# Altium project Module_wifi.PrjPcb
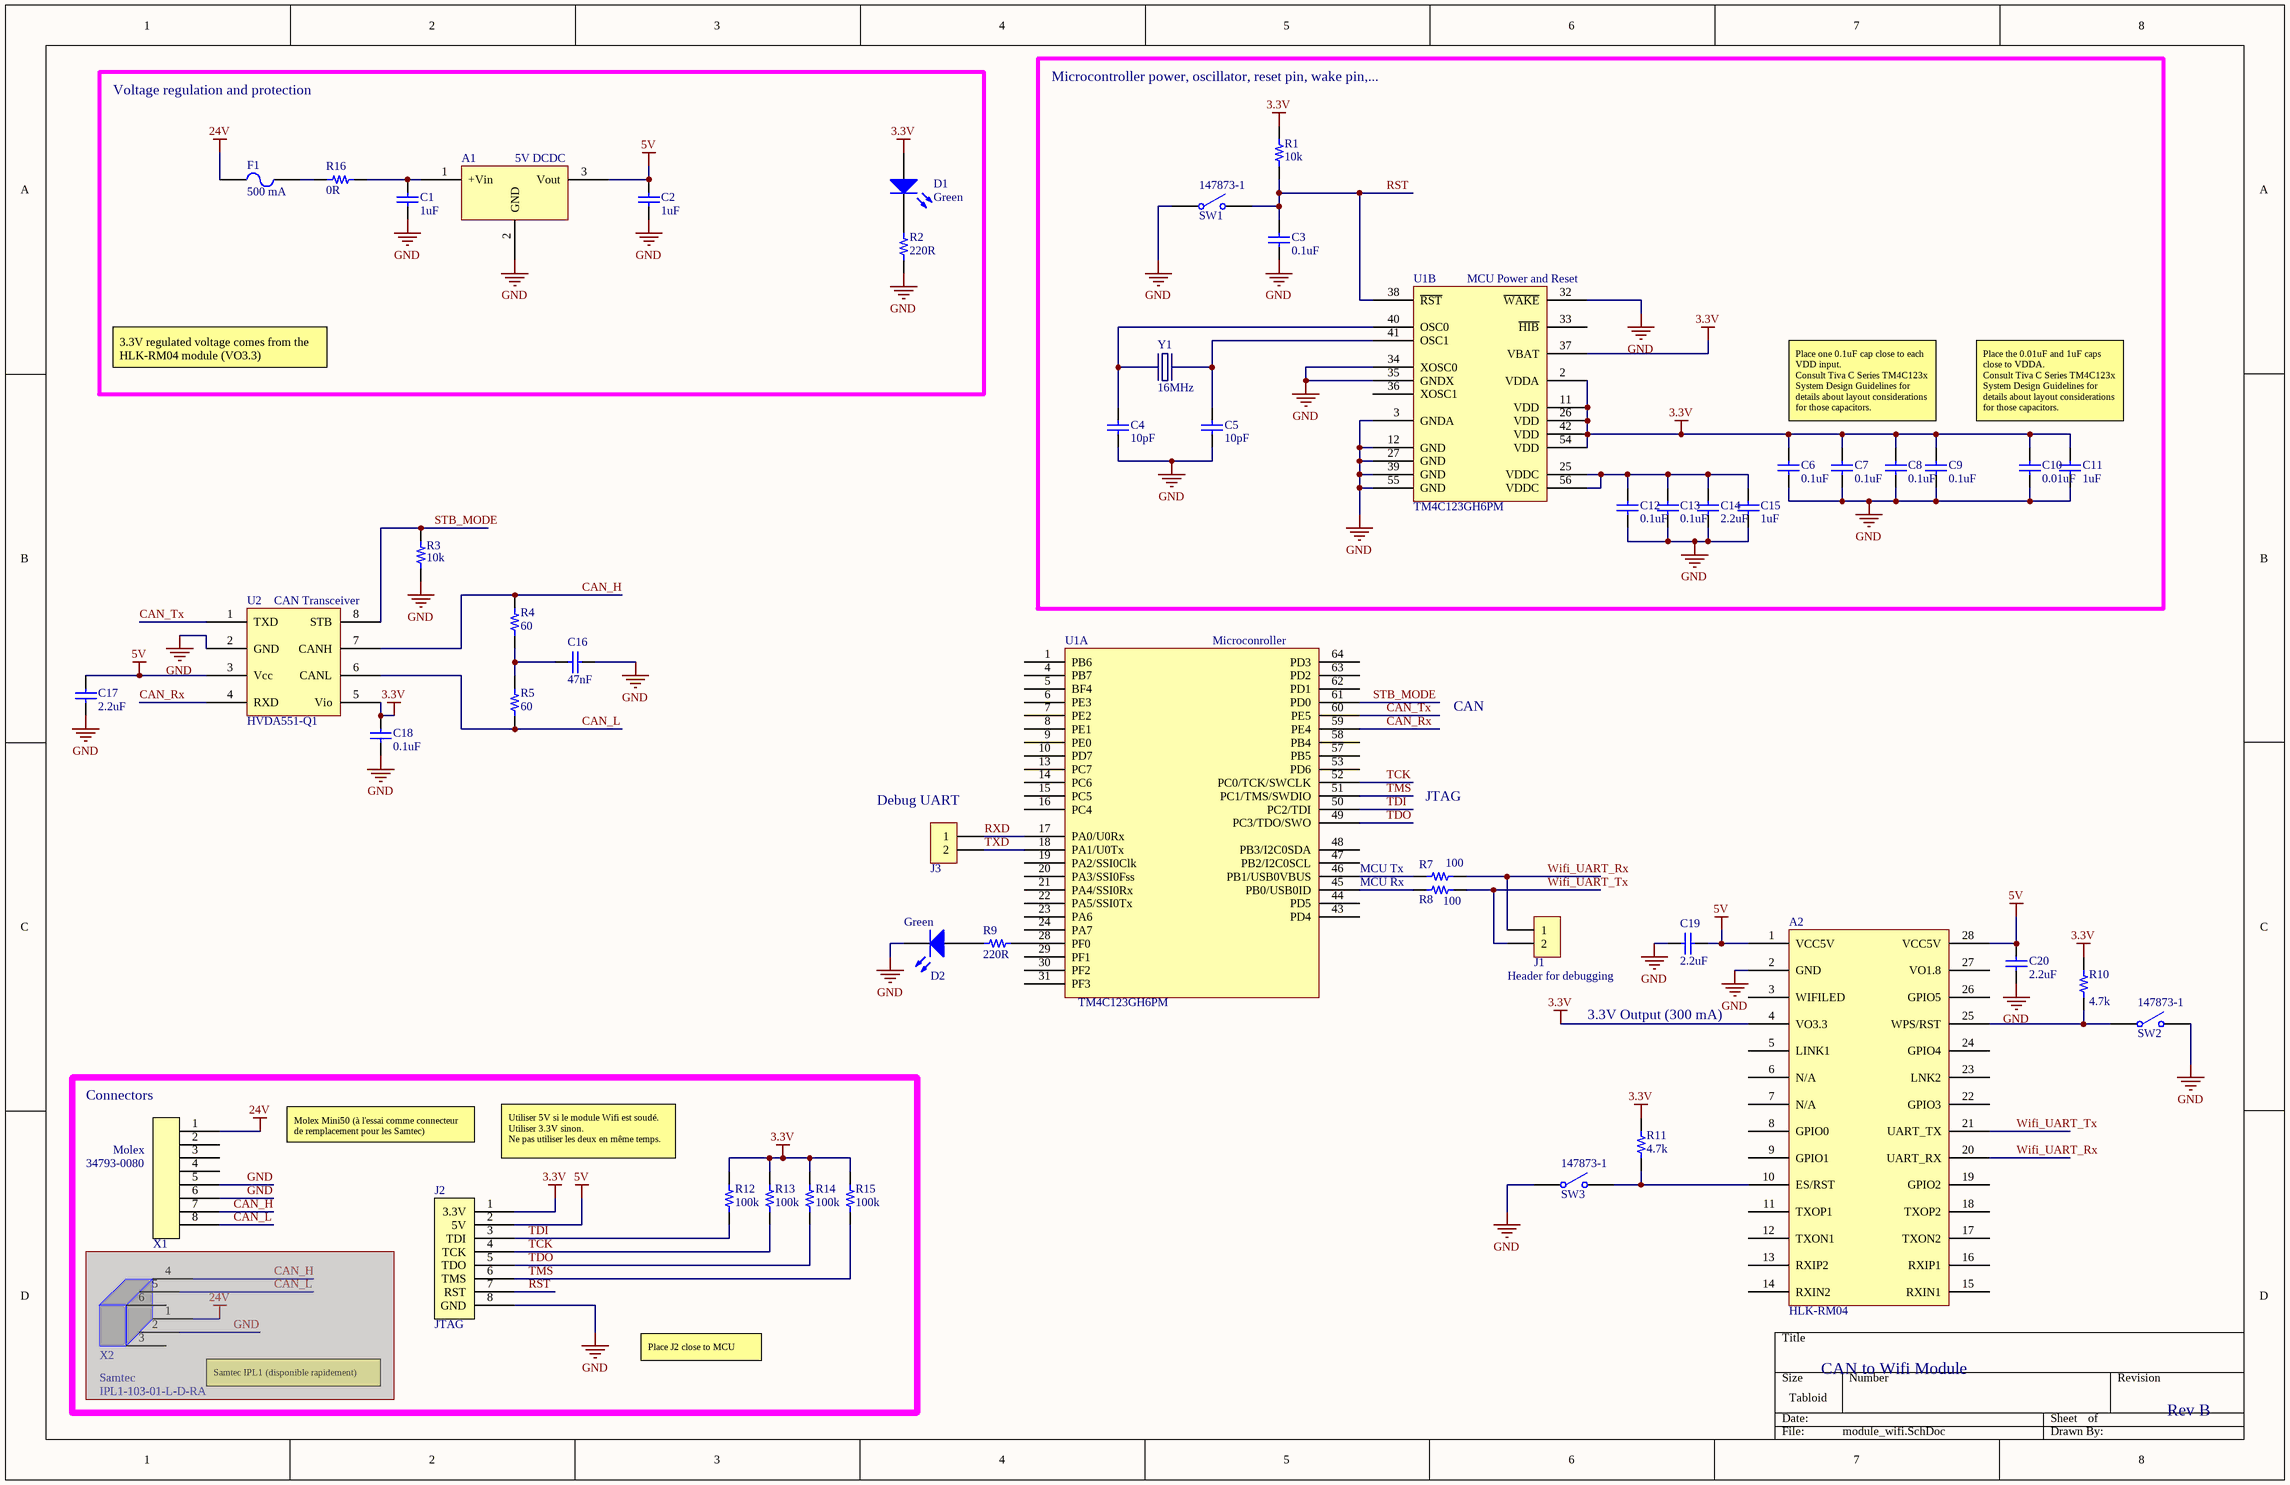
[diagram p0: module_wifi.SchDoc]
1 sheet, 51 parts. Net scope: global (net labels, ports and power ports of the same name join across sheets).
Board file: module_wifi.PcbDoc

## Sheet module_wifi.SchDoc
size Tabloid

### Parts
A1  5V DCDC  [R-78E-0.5]
A2  HLK-RM04  [HLK-RM04]
C1  value 1uF  [C0603]  (hidden comment: CAP CER 0603 1uF 25V X7R 20%)
C2  value 1uF  [C0603]  (hidden comment: CAP CER 0603 1uF 25V X7R 20%)
C3  value 0.1uF  [C0603]  (hidden comment: CAP CER 0603 0.1uF 50V C0G 10%)
C4  value 10pF  [C0603]  (hidden comment: CAP CER 0603 10pF 50V C0G 5%)
C5  value 10pF  [C0603]  (hidden comment: CAP CER 0603 10pF 50V C0G 5%)
C6  value 0.1uF  [C0603]  (hidden comment: CAP CER 0603 0.1uF 50V C0G 10%)
C7  value 0.1uF  [C0603]  (hidden comment: CAP CER 0603 0.1uF 50V C0G 10%)
C8  value 0.1uF  [C0603]  (hidden comment: CAP CER 0603 0.1uF 50V C0G 10%)
C9  value 0.1uF  [C0603]  (hidden comment: CAP CER 0603 0.1uF 50V C0G 10%)
C10  value 0.01uF  [C0603]  (hidden comment: CAP CER 0603 0.01uF 50V X7R 10%)
C11  value 1uF  [C0603]  (hidden comment: CAP CER 0603 1uF 25V X7R 20%)
C12  value 0.1uF  [C0603]  (hidden comment: CAP CER 0603 0.1uF 50V C0G 10%)
C13  value 0.1uF  [C0603]  (hidden comment: CAP CER 0603 0.1uF 50V C0G 10%)
C14  value 2.2uF  [C0603]  (hidden comment: CAP CER 0603 2.2uF 6.3V X7R 10%)
C15  value 1uF  [C0603]  (hidden comment: CAP CER 0603 1uF 25V X7R 20%)
C16  value 47nF  [C0603]  (hidden comment: CAP CER 0603 47nF 50V X7R 10%)
C17  value 2.2uF  [C0603]  (hidden comment: CAP CER 0603 2.2uF 6.3V X7R 10%)
C18  value 0.1uF  [C0603]  (hidden comment: CAP CER 0603 0.1uF 50V C0G 10%)
C19  value 2.2uF  [C0603]  (hidden comment: CAP CER 0603 2.2uF 6.3V X7R 10%)
C20  value 2.2uF  [C0603]  (hidden comment: CAP CER 0603 2.2uF 6.3V X7R 10%)
D1  Green  [LED1206]
D2  Green  [LED1206]
F1  value 500 mA  [Omni-Block_154T]  (hidden comment: Fuse Holder)
J1  Header for debugging  [HDR1X2]
J2  JTAG  [JTAG_Header]
J3  Header 2  [HDR1X2]  (value not drawn)
R1  value 10k  [R0603]  (hidden comment: RES 0603 10k 5% 0.1W)
R2  value 220R  [R0603]  (hidden comment: RES 0603 220R 5% 1/4W)
R3  value 10k  [R0603]  (hidden comment: RES 0603 10k 5% 0.1W)
R4  value 60  [R0603]  (hidden comment: RES 0603 60R 1% 1/4W)
R5  value 60  [R0603]  (hidden comment: RES 0603 60R 1% 1/4W)
R7  value 100  [R0603]  (hidden comment: RES 0603 100R 5% 1/4W)
R8  value 100  [R0603]  (hidden comment: RES 0603 100R 5% 1/4W)
R9  value 220R  [R0603]  (hidden comment: RES 0603 220R 5% 1/4W)
R10  value 4.7k  [R0603]  (hidden comment: RES 0603 4.7k 5% 0.1W)
R11  value 4.7k  [R0603]  (hidden comment: RES 0603 4.7k 5% 0.1W)
R12  value 100k  [R0603]  (hidden comment: RES 0603 100k 5% 0.1W)
R13  value 100k  [R0603]  (hidden comment: RES 0603 100k 5% 0.1W)
R14  value 100k  [R0603]  (hidden comment: RES 0603 100k 5% 0.1W)
R15  value 100k  [R0603]  (hidden comment: RES 0603 100k 5% 0.1W)
R16  value 0R  [R0603]  (hidden comment: RES 0603 0R)
SW1  147873-1  [147873]
SW2  147873-1  [147873]
SW3  147873-1  [147873]
U1  Microconroller  Part_Number: TM4C123GH6PM  [LQFP64]  (parts A,B of 2)
U2  CAN Transceiver  [SOIC-8]
X1  Manufacturer: Molex  [34791-0080]  (hidden comment: 34793-0080)
X2  Part_Number: IPL1-103-01-L-D-RA  Manufacturer: Samtec  [IPL1-103-XXX-D-RA]  (hidden comment: IPL1-106-01-L-D-RA)
Y1  value 16MHz  [NX5032GA]  (hidden comment: NX5043GA-16.00MHz)

### Blocks framed on the sheet
Voltage regulation and protection: A1 C1 C2 D1 F1 R2 R16
Microcontroller power, oscillator, reset pin, wake pin,...: C3-C15 R1 SW1 U1 Y1
Connectors: J2 R12-R15 X1 X2

### Nets
3.3V: A2.4(VO3.3) C6.2 C7.2 C8.2 C9.2 C10.2 C11.2 C18.2 D1.1(A) J2.1(3.3V) R1.2 R10.2 R11.2 R12.2 R13.2 R14.2 R15.2 U1.2(VDDA) U1.11(VDD) U1.26(VDD) U1.37(VBAT) U1.42(VDD) U1.54(VDD) U2.5(Vio)
5V: A1.3(Vout) A2.1(VCC5V) A2.28(VCC5V) C2.2 C17.2 C19.1 C20.2 J2.2(5V) U2.3(Vcc)
24V: F1.2 X1.1
GND: A1.2(GND) A2.2(GND) C1.1 C2.1 C3.1 C4.1 C5.1 C6.1 C7.1 C8.1 C9.1 C10.1 C11.1 C12.1 C13.1 C14.1 C15.1 C16.2 C17.1 C18.1 C19.2 C20.1 D2.2(K) J2.8(GND) R2.1 R3.1 SW1.1(COMMON) SW2.2(NO) SW3.1(COMMON) U1.3(GNDA) U1.12(GND) U1.27(GND) U1.32(~{WAKE}) U1.34(XOSC0) U1.35(GNDX) U1.39(GND) U1.55(GND) U2.2(GND) X1.5 X1.6
CAN_H: R4.2 U2.7(CANH) X1.7
CAN_L: R5.1 U2.6(CANL) X1.8
CAN_Rx: U1.59(PE4) U2.4(RXD)
CAN_Tx: U1.60(PE5) U2.1(TXD)
RST: C3.2 J2.7(RST) R1.1 SW1.2(NO) U1.38(~{RST})
RXD: J3.1 U1.17(PA0/U0Rx)
STB_MODE: R3.2 U1.61(PD0) U2.8(STB)
TCK: J2.4(TCK) R13.1 U1.52(PC0/TCK/SWCLK)
TDI: J2.3(TDI) R12.1 U1.50(PC2/TDI)
TDO: J2.5(TDO) R14.1 U1.49(PC3/TDO/SWO)
TMS: J2.6(TMS) R15.1 U1.51(PC1/TMS/SWDIO)
TXD: J3.2 U1.18(PA1/U0Tx)
Wifi_UART_Rx: A2.20(UART_RX) J1.1 R7.1
Wifi_UART_Tx: A2.21(UART_TX) J1.2 R8.1
NetA1_1: A1.1(+Vin) C1.2 R16.2
NetA2_10: A2.10(ES/RST) R11.1 SW3.2(NO)
NetA2_25: A2.25(WPS/RST) R10.1 SW2.1(COMMON)
NetC4_2: C4.2 U1.40(OSC0) Y1.1
NetC5_2: C5.2 U1.41(OSC1) Y1.2
NetC12_2: C12.2 C13.2 C14.2 C15.2 U1.25(VDDC) U1.56(VDDC)
NetC16_1: C16.1 R4.1 R5.2
NetD1_2: D1.2(K) R2.2
NetD2_1: D2.1(A) R9.1
NetF1_1: F1.1 R16.1
NetR7_2: R7.2 U1.46(PB1/USB0VBUS)
NetR8_2: R8.2 U1.45(PB0/USB0ID)
NetR9_2: R9.2 U1.28(PF0)

Not connected (* = marked no-connect by the designer): A2 3(WIFILED) 5(LINK1) 6(N/A) 7(N/A) 8(GPIO0) 9(GPIO1) 11(TXOP1) 12(TXON1) 13(RXIP2) 14(RXIN2) 15(RXIN1) 16(RXIP1) 17(TXON2) 18(TXOP2) 19(GPIO2) 22(GPIO3) 23(LNK2) 24(GPIO4) 26(GPIO5) 27(VO1.8); U1 1(PB6) 4(PB7) 5(BF4) 6(PE3) 7(PE2) 8(PE1) 9(PE0) 10(PD7) 13(PC7) 14(PC6) 15(PC5) 16(PC4) 19(PA2/SSI0Clk) 20(PA3/SSI0Fss) 21(PA4/SSI0Rx) 22(PA5/SSI0Tx) 23(PA6) 24(PA7) 29(PF1) 30(PF2) 31(PF3) 33(~{HIB}) 36(XOSC1) 43(PD4) 44(PD5) 47(PB2/I2C0SCL) 48(PB3/I2C0SDA) 53(PD6) 57(PB5) 58(PB4) 62(PD1) 63(PD2) 64(PD3); X1 2 3 4; X2 1 2 3 4 5 6

### Notes on the sheet
- 3.3V regulated voltage comes from the HLK-RM04 module (VO3.3)
- Place one 0.1uF cap close to each VDD input.
  Consult Tiva C Series TM4C123x System Design Guidelines for details about layout considerations for those capacitors.
- Place the 0.01uF and 1uF caps close to VDDA.
  Consult Tiva C Series TM4C123x System Design Guidelines for details about layout considerations for those capacitors.
- CAN
- (near J3) Debug UART
- JTAG
- MCU Rx
- MCU Tx
- 3.3V Output (300 mA)
- Molex Mini50 (à l'essai comme connecteur de remplacement pour les Samtec)
- Utiliser 5V si le module Wifi est soudé.
  Utiliser 3.3V sinon.
  Ne pas utiliser les deux en même temps.
- Place J2 close to MCU
- CAN to Wifi Module
- Samtec IPL1 (disponible rapidement)
- Rev B

### Library data of the parts
A1 = R78E5.0-0.5: Manufacturer: Recom; Part_Number: R-78E5.0-0.5; Vin: 7-28V; Iout: 500mA; Efficiency: 82-92%; Supplier_Link: http://www.digikey.ca/product-detail/en/R-78E5.0-0.5/945-1648-5-ND/2834904; Vout: 5V
A2 = HLK-RM04: Wifi Module; Manufacturer: Hi-Link; Supplier_Link: http://www.hlktech.net/product_detail.php?ProId=39; Price: 9.50; Part_Number: HLK-RM04
C1 C2 C11 C15 = CAP CER 0603 1uF 25V X7R 20%: 1uF ceramic capacitor; Manufacturer: TDK Corporation; Manufacturer Part Number: CGA3E1X7R1E105M080AC; Supplier_Link: http://www.digikey.ca/product-detail/en/CGA3E1X7R1E105M080AC/445-12548-1-ND/3954214; Tolerance: 20%; Voltage rating: 25V
C3 C6-C9 C12 C13 C18 = CAP CER 0603 0.1uF 50V C0G 10%: 0.1uF ceramic capacitor; Manufacturer: TDK Corporation; Manufacturer Part Number: CGA3E2X7R1H104K080AA; Supplier_Link: http://www.digikey.ca/product-detail/en/CGA3E2X7R1H104K080AA/445-5666-1-ND/2443706; Tolerance: 10%; Voltage rating: 50V
C4 C5 = CAP CER 0603 10pF 50V C0G 5%: 10pF ceramic capacitor; Manufacturer: TDK Corporation; Manufacturer Part Number: CGA3E2C0G1H100D080AA; Supplier_Link: http://www.digikey.ca/product-detail/en/CGA3E2C0G1H100D080AA/445-5628-1-ND/2443668; Tolerance: 5%; Voltage rating: 50V
C10 = CAP CER 0603 0.01uF 50V X7R 10%: 0.01uF ceramic capacitor; Manufacturer: TDK Corporation; Manufacturer Part Number: CGA3E2X7R1H103K080AA; Supplier_Link: http://www.digikey.ca/product-detail/en/CGA3E2X7R1H103K080AA/445-5662-1-ND/2443702; Tolerance: 10%; Voltage rating: 50V
C14 C17 C19 C20 = CAP CER 0603 2.2uF 6.3V X7R 10%: 2.2uF ceramic capacitor; Manufacturer: TDK Corporation; Manufacturer Part Number: CGA3E1X7R0J225K080AC; Supplier_Link: http://www.digikey.ca/product-detail/en/CGA3E1X7R0J225K080AC/445-6933-1-ND/2672951; Tolerance: 10%; Voltage rating: 6.3V; Price: 0.32
C16 = CAP CER 0603 47nF 50V X7R 10%: 47nF ceramic capacitor; Manufacturer: TDK Corporation; Manufacturer Part Number: CGA3E2X7R1H473K080AA; Supplier_Link: http://www.digikey.ca/product-detail/en/CGA3E2X7R1H473K080AA/445-5664-1-ND/2443704; Tolerance: 10%; Voltage rating: 50V; Price: 0.14
D1 D2 = LTST-C150KGKT: Green LED 1206; Manufacturer: Liteon; Part_Number: LTST-C150KGKT; Supplier_Link: http://www.digikey.ca/product-detail/en/LTST-C150KGKT/160-1404-1-ND/386759; Price: 0.55; Price_10: 0.40
F1 = 0154010.DR: Nano 452 fuse holder, surface mount; Manufacturer: Littlefuse; Part_Number: 0154010.DR; Supplier_Link: http://www.digikey.ca/product-search/en?pv66=1&FV=ffec3b86%2Cffec3bb8%2Cffec4f0c%2Cffec8a72%2Cfff4000a%2Cfff8003d%2Cfffc0012%2C1c0002%2C1c0003%2C1c0006&mnonly=0&newproducts=0&ColumnSort=0&page=1&stock=1&quantity=0&ptm=0&fid=0&pageSize=500; Price: 3.64
J1 J3 = Header 2: Header, 2-Pin
J2 = JTAG_Header: JTAG header, MCU programming
R1 R3 = RES 0603 10k 5% 0.1W: 10 kOhms resistor; Part_Number: CRCW060310K0JNEA; Manufacturer: Vishay; Price: 0.11; Supplier_Link: http://www.digikey.ca/product-detail/en/CRCW060310K0JNEA/541-10KGCT-ND/1179393
R2 R9 = RES 0603 220R 5% 1/4W: 220 Ohms resistor, 1/4W; Part_Number: ESR03EZPJ221; Manufacturer: Rohm Semiconductor; Price: 0.15; Supplier_Link: http://www.digikey.ca/product-detail/en/ESR03EZPJ221/RHM220DCT-ND/1983788
R4 R5 = RES 0603 60R 1% 1/4W: 60 Ohms resistor, 1/4W; Part_Number: ESR03EZPJ620; Manufacturer: Rohm Semiconductor; Price: 0.15; Supplier_Link: http://www.digikey.ca/product-detail/en/ESR03EZPJ620/RHM62DCT-ND/1983794
R7 R8 = RES 0603 100R 5% 1/4W: 100 Ohms resistor, 1/4W; Part_Number: ESR03EZPJ101; Manufacturer: Rohm Semiconductor; Price: 0.15; Supplier_Link: http://www.digikey.ca/product-detail/en/ESR03EZPJ101/RHM100DCT-ND/1983776
R10 R11 = RES 0603 4.7k 5% 0.1W: 4.7 kOhms resistor; Part_Number: CRCW06034K70JNEA; Manufacturer: Vishay; Price: 0.11; Supplier_Link: http://www.digikey.ca/product-detail/en/CRCW06034K70JNEA/541-4.7KGCT-ND/1179385
R12-R15 = RES 0603 100k 5% 0.1W: 100 kOhm resistor; Part_Number: CRCW0603100KJNEA; Manufacturer: Vishay; Price: 0.11; Supplier_Link: http://www.digikey.ca/product-detail/en/CRCW0603100KJNEA/541-100KGCT-ND/1179417
R16 = RES 0603 0R: 0 Ohm resistor; Part_Number: CRCW06030000Z0EA; Manufacturer: Vishay; Price: 0.11; Supplier_Link: http://www.digikey.ca/product-detail/en/CRCW06030000Z0EA/541-0.0GCT-ND/1179296
SW1-SW3 = 147873-1: Pushbutton switch SPST, 2 pins; Manufacturer: TE Connectivity; Price: 0.30; Part_Number: 147873-1
  SW1 SW2: Supplier_Link: http://ca.mouser.com/ProductDetail/TE-Connectivity-Alcoswitch/147873-1/?qs=sGAEpiMZZMvxtGF7dlGNpsxRhg8g8FqHC2R98arEfD8%3d
  SW3: Supplier_Link: http://www.te.com/usa-en/product-147873-1.html
U1 = TM4C123GN6PM: 32 bit Microcontroller; Manufacturer: Texas Instrument; Price: 8.50; Supplier_Link: http://www.ti.com/product/TM4C123GH6PM/samplebuy
U2 = HVDA551-Q1: Automotive 5-V CAN Transceiver with I/O Level Adapting and Low-Power Mode Supply Optimization; Manufacturer: Texas Instrument; Supplier_Link: http://www.ti.com/product/HVDA551-Q1/samplebuy; Supplier 1: Digi-Key; Supplier Part Number 1: 296-40116-1-ND; Type: CAN Transceiver; Manufacturer Part Number: HVDA551-Q1
X1 = 34793-0080: Molex Mini50, 8 position, single row, right angle; Part_Number: 34793-0080; Supplier_Link: http://www.digikey.ca/product-search/en?vendor=0&keywords=34793-0080; Price: 2.13
X2 = IPL1-106-01-L-D-RA: Samtec IPL1, 6 pins, dual row, right angle
Y1 = NX5043GA-16.00MHz: Crystal Oscillator 16 MHz; Manufacturer: NDK; Part_Number: NX5032GA-16.000M-LN-CD-1; ESR: 120 Ohms; Supplier_Link: http://www.digikey.ca/product-detail/en/NX5032GA-16.000000MHZ-LN-CD-1/644-1037-1-ND/1128909